# Altium schematic sheet SDADC.SchDoc: SDADC
size 420 x 297 mm; Date: March 14; CheckedBy: ThS. Bùi Quốc Bảo; DrawnBy: Nguyễn Gia Huy; Revision: V1.0; SheetNumber: 9; SheetTotal: 11; MasterProject: STM32-PLC; Sub-system: DA1_prj.PrjPcb
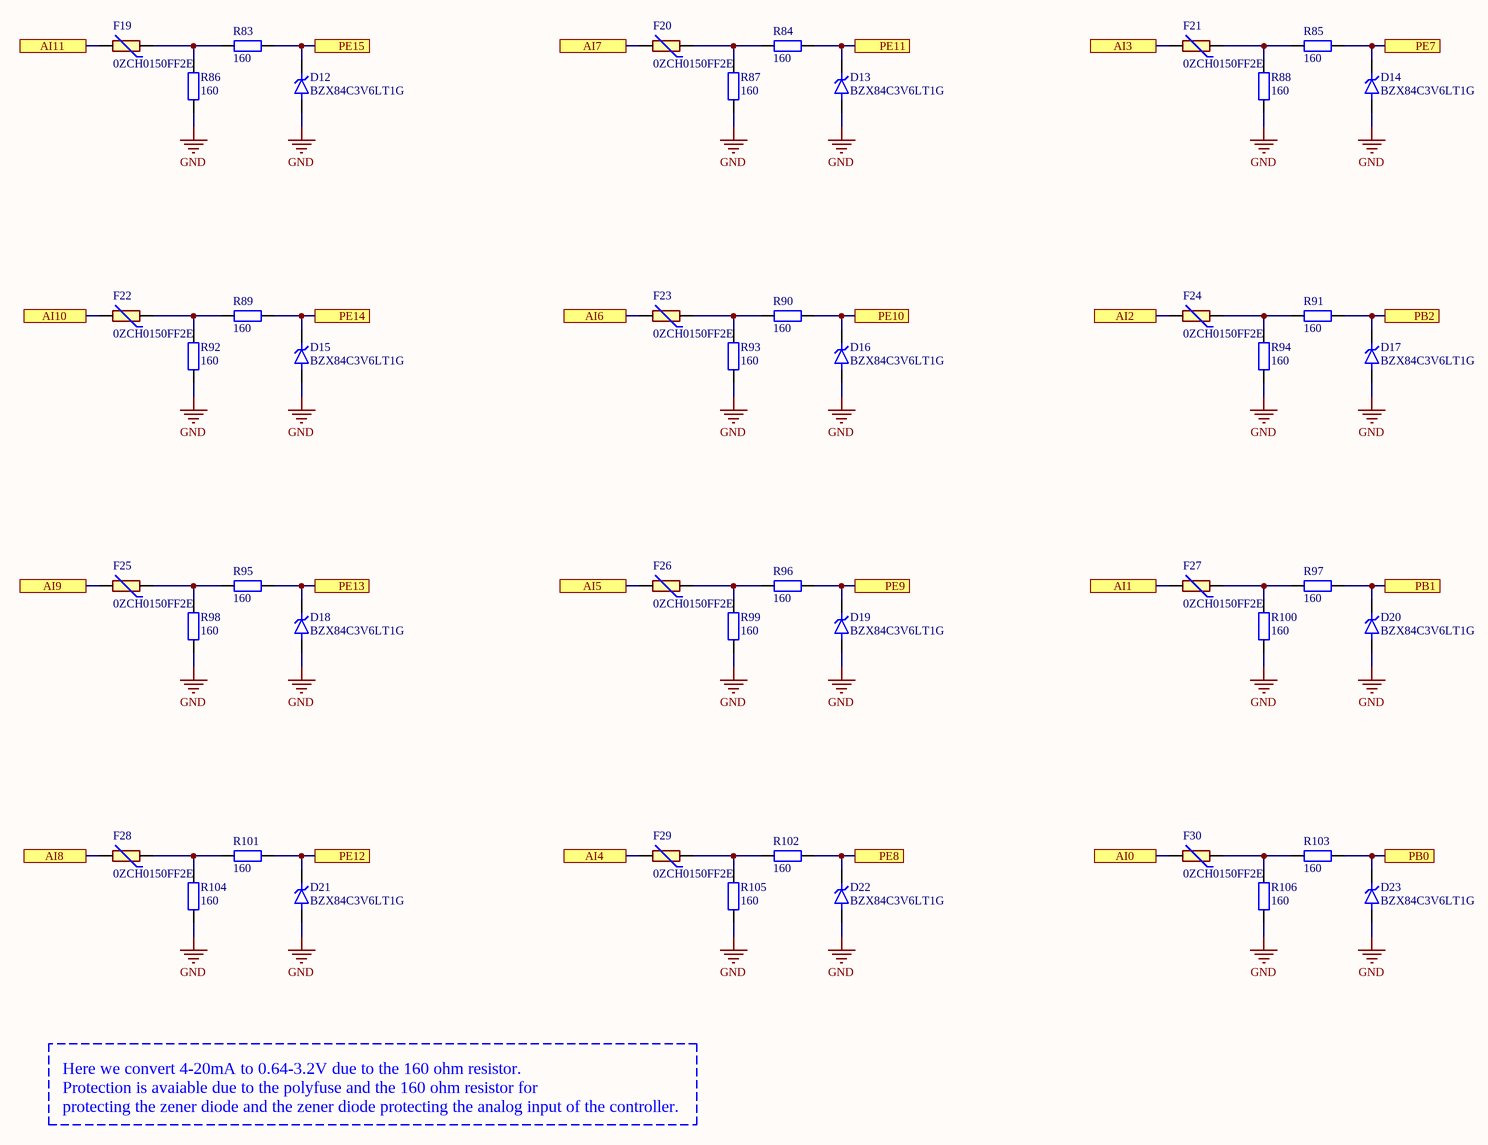
[diagram p0: SDADC.SchDoc]

## Parts
D12  BZX84C3V6LT1G  [SOT95P240X111-3N]
D13  BZX84C3V6LT1G  [SOT95P240X111-3N]
D14  BZX84C3V6LT1G  [SOT95P240X111-3N]
D15  BZX84C3V6LT1G  [SOT95P240X111-3N]
D16  BZX84C3V6LT1G  [SOT95P240X111-3N]
D17  BZX84C3V6LT1G  [SOT95P240X111-3N]
D18  BZX84C3V6LT1G  [SOT95P240X111-3N]
D19  BZX84C3V6LT1G  [SOT95P240X111-3N]
D20  BZX84C3V6LT1G  [SOT95P240X111-3N]
D21  BZX84C3V6LT1G  [SOT95P240X111-3N]
D22  BZX84C3V6LT1G  [SOT95P240X111-3N]
D23  BZX84C3V6LT1G  [SOT95P240X111-3N]
F19  0ZCH0150FF2E  [FUSC3225X90N]
F20  0ZCH0150FF2E  [FUSC3225X90N]
F21  0ZCH0150FF2E  [FUSC3225X90N]
F22  0ZCH0150FF2E  [FUSC3225X90N]
F23  0ZCH0150FF2E  [FUSC3225X90N]
F24  0ZCH0150FF2E  [FUSC3225X90N]
F25  0ZCH0150FF2E  [FUSC3225X90N]
F26  0ZCH0150FF2E  [FUSC3225X90N]
F27  0ZCH0150FF2E  [FUSC3225X90N]
F28  0ZCH0150FF2E  [FUSC3225X90N]
F29  0ZCH0150FF2E  [FUSC3225X90N]
F30  0ZCH0150FF2E  [FUSC3225X90N]
R83  160  [tro smd 0603]
R84  160  [tro smd 0603]
R85  160  [tro smd 0603]
R86  160  [tro smd 0603]
R87  160  [tro smd 0603]
R88  160  [tro smd 0603]
R89  160  [tro smd 0603]
R90  160  [tro smd 0603]
R91  160  [tro smd 0603]
R92  160  [tro smd 0603]
R93  160  [tro smd 0603]
R94  160  [tro smd 0603]
R95  160  [tro smd 0603]
R96  160  [tro smd 0603]
R97  160  [tro smd 0603]
R98  160  [tro smd 0603]
R99  160  [tro smd 0603]
R100  160  [tro smd 0603]
R101  160  [tro smd 0603]
R102  160  [tro smd 0603]
R103  160  [tro smd 0603]
R104  160  [tro smd 0603]
R105  160  [tro smd 0603]
R106  160  [tro smd 0603]

## Ports
AI0 (see STM32_PLC[4C]), AI1 (see STM32_PLC[4C]), AI2 (see STM32_PLC[4C]), AI3 (see STM32_PLC[4B]), AI4 (see STM32_PLC[4B]), AI5 (see STM32_PLC[4B]), AI6 (see STM32_PLC[4B]), AI7 (see STM32_PLC[4B]), AI8 (see STM32_PLC[4B]), AI9 (see STM32_PLC[4B]), AI10 (see STM32_PLC[4B]), AI11 (see STM32_PLC[4B]), PB0 (see STM32_PLC[2B], STM32_PLC[4C], STM32_PLC[5C]), PB1 (see STM32_PLC[2B], STM32_PLC[4C], STM32_PLC[5C]), PB2 (see STM32_PLC[2B], STM32_PLC[4C], STM32_PLC[5C]), PE7 (see STM32_PLC[2C], STM32_PLC[4B], STM32_PLC[5B]), PE8 (see STM32_PLC[2C], STM32_PLC[4B], STM32_PLC[5B]), PE9 (see STM32_PLC[2C], STM32_PLC[4B], STM32_PLC[5B]), PE10 (see STM32_PLC[2C], STM32_PLC[4B], STM32_PLC[5B]), PE11 (see STM32_PLC[2C], STM32_PLC[4B], STM32_PLC[5B]), PE12 (see STM32_PLC[2C], STM32_PLC[4B], STM32_PLC[5B]), PE13 (see STM32_PLC[2C], STM32_PLC[4B], STM32_PLC[5B]), PE14 (see STM32_PLC[2C], STM32_PLC[4B], STM32_PLC[5B]), PE15 (see STM32_PLC[2C], STM32_PLC[4B], STM32_PLC[5B])

## Nets
GND: D12.1(A) D13.1(A) D14.1(A) D15.1(A) D16.1(A) D17.1(A) D18.1(A) D19.1(A) D20.1(A) D21.1(A) D22.1(A) D23.1(A) R86.1 R87.1 R88.1 R92.1 R93.1 R94.1 R98.1 R99.1 R100.1 R104.1 R105.1 R106.1
AI0: F30.2 ; port AI0
AI1: F27.2 ; port AI1
AI2: F24.2 ; port AI2
AI3: F21.2 ; port AI3
AI4: F29.2 ; port AI4
AI5: F26.2 ; port AI5
AI6: F23.2 ; port AI6
AI7: F20.2 ; port AI7
AI8: F28.2 ; port AI8
AI9: F25.2 ; port AI9
AI10: F22.2 ; port AI10
AI11: F19.2 ; port AI11
PB0: D23.3(K) R103.2 ; port PB0
PB1: D20.3(K) R97.2 ; port PB1
PB2: D17.3(K) R91.2 ; port PB2
PE7: D14.3(K) R85.2 ; port PE7
PE8: D22.3(K) R102.2 ; port PE8
PE9: D19.3(K) R96.2 ; port PE9
PE10: D16.3(K) R90.2 ; port PE10
PE11: D13.3(K) R84.2 ; port PE11
PE12: D21.3(K) R101.2 ; port PE12
PE13: D18.3(K) R95.2 ; port PE13
PE14: D15.3(K) R89.2 ; port PE14
PE15: D12.3(K) R83.2 ; port PE15
NetF19_1: F19.1 R83.1 R86.2
NetF20_1: F20.1 R84.1 R87.2
NetF21_1: F21.1 R85.1 R88.2
NetF22_1: F22.1 R89.1 R92.2
NetF23_1: F23.1 R90.1 R93.2
NetF24_1: F24.1 R91.1 R94.2
NetF25_1: F25.1 R95.1 R98.2
NetF26_1: F26.1 R96.1 R99.2
NetF27_1: F27.1 R97.1 R100.2
NetF28_1: F28.1 R101.1 R104.2
NetF29_1: F29.1 R102.1 R105.2
NetF30_1: F30.1 R103.1 R106.2

## Notes on the sheet
- Here we convert 4-20mA to 0.64-3.2V due to the 160 ohm resistor.
  Protection is avaiable due to the polyfuse and the 160 ohm resistor for
  protecting the zener diode and the zener diode protecting the analog input of the controller.
- Sub-system:
- Project:
- Design by:
- Sheet title:
- Sheet
- of
- Checked by:
- Approved by:
- Doc No:
- Revision:
- Size:
- Dates:
- A3

## Library data of the parts
F19-F30 = 0ZCH0150FF2E: 1210 SMT PPTC | 1.50 Ih | 6V; MF: Bel Fuse; SnapEDA_Link: https://www.snapeda.com/parts/0ZCH0150FF2E/Bel+Circuit+Protection/view-part/?ref=snap; Package: Package; Value: *; MP: 0ZCH0150FF2E; Check_prices: https://www.snapeda.com/parts/0ZCH0150FF2E/Bel+Circuit+Protection/view-part/?ref=eda
R83-R106 = Tro 0603 1% 10k: RES; Chung_Loai: Dán; Don_Vi: Con; So_Chan: 2; Ten_Linh_Kien: Trở 0603 1% 10k; Ma_Hang: MH006333; Kieu_Chan: *
D12-D23 = BZX84C3V6LT1G: Package: None; Price: None; Value: *; MP: BZX84C3V6LT1G; Availability: Unavailable